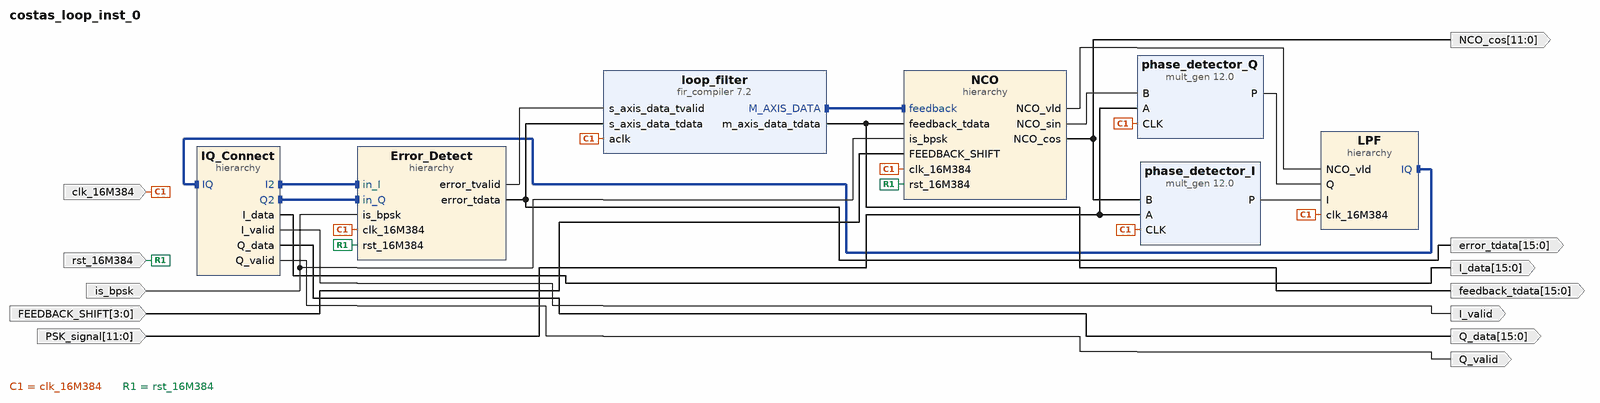
[diagram p0: block diagram of the top level]
# Vivado block design costas_loop_inst_0, xc7z020clg484-1, Vivado 2022.2
create_bd_design costas_loop_inst_0

create_bd_port -dir I -type clk clk_16M384
create_bd_port -dir I -from 11 -to 0 -type data PSK_signal
create_bd_port -dir I is_bpsk
create_bd_port -dir I -type rst rst_16M384
create_bd_port -dir O -from 11 -to 0 NCO_cos
create_bd_port -dir I -from 3 -to 0 -type data FEEDBACK_SHIFT
create_bd_port -dir O -from 15 -to 0 I_data
create_bd_port -dir O I_valid
create_bd_port -dir O -from 15 -to 0 Q_data
create_bd_port -dir O Q_valid
create_bd_port -dir O -from 15 -to 0 error_tdata
create_bd_port -dir O -from 15 -to 0 feedback_tdata

create_bd_cell -type ip -vlnv xilinx.com:ip:mult_gen:12.0 phase_detector_I
set_property -dict [list \
  CONFIG.Multiplier_Construction Use_Mults \
  CONFIG.OutputWidthHigh 23 \
  CONFIG.OutputWidthLow 8 \
  CONFIG.PipeStages 3 \
  CONFIG.PortAType Signed \
  CONFIG.PortAWidth 12 \
  CONFIG.PortBType Signed \
  CONFIG.PortBWidth 12 \
  CONFIG.Use_Custom_Output_Width true \
] [get_bd_cells phase_detector_I]
create_bd_cell -type ip -vlnv xilinx.com:ip:mult_gen:12.0 phase_detector_Q
set_property -dict [list \
  CONFIG.Multiplier_Construction Use_Mults \
  CONFIG.OutputWidthHigh 23 \
  CONFIG.OutputWidthLow 8 \
  CONFIG.PipeStages 3 \
  CONFIG.PortAType Signed \
  CONFIG.PortAWidth 12 \
  CONFIG.PortBType Signed \
  CONFIG.PortBWidth 12 \
  CONFIG.Use_Custom_Output_Width true \
] [get_bd_cells phase_detector_Q]
create_bd_cell -type ip -vlnv xilinx.com:ip:fir_compiler:7.2 loop_filter
set_property -dict [list \
  CONFIG.Clock_Frequency 16.384 \
  CONFIG.CoefficientSource COE_File \
  CONFIG.Coefficient_File ../../../../../../../../matlab/costas_loop_LPF.coe \
  CONFIG.Coefficient_Fractional_Bits 0 \
  CONFIG.Coefficient_Sets 1 \
  CONFIG.Coefficient_Sign Signed \
  CONFIG.Coefficient_Structure Inferred \
  CONFIG.Coefficient_Width 16 \
  CONFIG.ColumnConfig 14 \
  CONFIG.DATA_Has_TLAST Not_Required \
  CONFIG.Data_Width 16 \
  CONFIG.Filter_Architecture Systolic_Multiply_Accumulate \
  CONFIG.M_DATA_Has_TUSER Not_Required \
  CONFIG.Number_Channels 1 \
  CONFIG.Number_Paths 1 \
  CONFIG.Output_Rounding_Mode Truncate_LSBs \
  CONFIG.Output_Width 16 \
  CONFIG.Quantization Integer_Coefficients \
  CONFIG.RateSpecification Frequency_Specification \
  CONFIG.S_DATA_Has_TUSER Not_Required \
  CONFIG.SamplePeriod 1 \
  CONFIG.Sample_Frequency 16.384 \
  CONFIG.Select_Pattern All \
] [get_bd_cells loop_filter]
create_bd_cell -type hier Error_Detect
create_bd_cell -type hier IQ_Connect
create_bd_cell -type hier LPF
create_bd_cell -type hier NCO

# ---- hierarchy /Error_Detect ----
current_bd_instance /Error_Detect
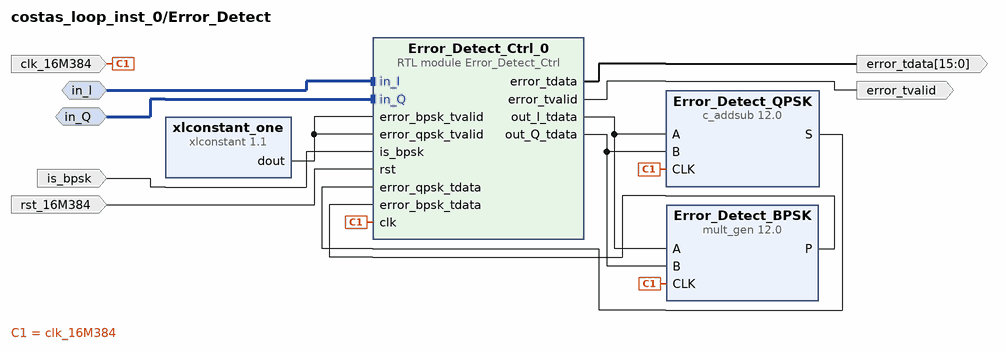
[diagram p1: block diagram inside /Error_Detect]
create_bd_intf_pin -mode Slave -vlnv xilinx.com:interface:axis_rtl:1.0 in_I
create_bd_intf_pin -mode Slave -vlnv xilinx.com:interface:axis_rtl:1.0 in_Q
create_bd_pin -dir I -type clk clk_16M384
create_bd_pin -dir I -type rst rst_16M384
create_bd_pin -dir I is_bpsk
create_bd_pin -dir O -from 15 -to 0 error_tdata
create_bd_pin -dir O error_tvalid

create_bd_cell -type ip -vlnv xilinx.com:ip:mult_gen:12.0 Error_Detect_BPSK
set_property -dict [list \
  CONFIG.Multiplier_Construction Use_Mults \
  CONFIG.OutputWidthHigh 31 \
  CONFIG.OutputWidthLow 16 \
  CONFIG.PipeStages 2 \
  CONFIG.PortAType Signed \
  CONFIG.PortAWidth 16 \
  CONFIG.PortBType Signed \
  CONFIG.PortBWidth 16 \
  CONFIG.Use_Custom_Output_Width true \
] [get_bd_cells Error_Detect_BPSK]
create_bd_cell -type ip -vlnv xilinx.com:ip:c_addsub:12.0 Error_Detect_QPSK
set_property -dict [list \
  CONFIG.A_Type Signed \
  CONFIG.A_Width 16 \
  CONFIG.Add_Mode Subtract \
  CONFIG.B_Type Signed \
  CONFIG.B_Value 0000000000000000 \
  CONFIG.B_Width 16 \
  CONFIG.CE false \
  CONFIG.Implementation DSP48 \
  CONFIG.Latency 2 \
  CONFIG.Out_Width 16 \
] [get_bd_cells Error_Detect_QPSK]
create_bd_cell -type ip -vlnv xilinx.com:ip:xlconstant:1.1 xlconstant_one
create_bd_cell -type module -reference Error_Detect_Ctrl Error_Detect_Ctrl_0

# ---- hierarchy /IQ_Connect ----
current_bd_instance /IQ_Connect
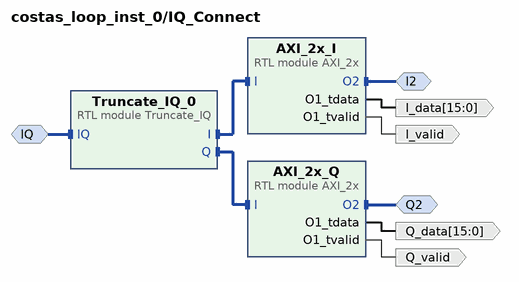
[diagram p2: block diagram inside /IQ_Connect]
create_bd_intf_pin -mode Master -vlnv xilinx.com:interface:axis_rtl:1.0 I2
create_bd_intf_pin -mode Master -vlnv xilinx.com:interface:axis_rtl:1.0 Q2
create_bd_intf_pin -mode Slave -vlnv xilinx.com:interface:axis_rtl:1.0 IQ
create_bd_pin -dir O -from 15 -to 0 I_data
create_bd_pin -dir O I_valid
create_bd_pin -dir O -from 15 -to 0 Q_data
create_bd_pin -dir O Q_valid

create_bd_cell -type module -reference AXI_2x AXI_2x_I
create_bd_cell -type module -reference AXI_2x AXI_2x_Q
create_bd_cell -type module -reference Truncate_IQ Truncate_IQ_0
set_property -dict {CONFIG.I_WIDTH 80 CONFIG.MSB_TRUNCATE_BITS 6} [get_bd_cells Truncate_IQ_0]

# ---- hierarchy /LPF ----
current_bd_instance /LPF
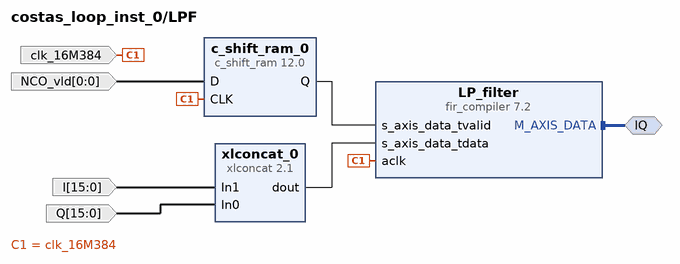
[diagram p3: block diagram inside /LPF]
create_bd_intf_pin -mode Master -vlnv xilinx.com:interface:axis_rtl:1.0 IQ
create_bd_pin -dir I -from 15 -to 0 I
create_bd_pin -dir I -from 15 -to 0 Q
create_bd_pin -dir I -type clk clk_16M384
create_bd_pin -dir I -from 0 -to 0 -type data NCO_vld

create_bd_cell -type ip -vlnv xilinx.com:ip:xlconcat:2.1 xlconcat_0
set_property -dict {CONFIG.IN0_WIDTH 16 CONFIG.IN1_WIDTH 16} [get_bd_cells xlconcat_0]
create_bd_cell -type ip -vlnv xilinx.com:ip:fir_compiler:7.2 LP_filter
set_property -dict [list \
  CONFIG.Clock_Frequency 16.384 \
  CONFIG.CoefficientSource COE_File \
  CONFIG.CoefficientVector 6,0,-4,-3,5,6,-6,-13,7,44,64,44,7,-13,-6,6,5,-3,-4,0,6 \
  CONFIG.Coefficient_File ../../../../../../../../matlab/costas_loop_LPF.coe \
  CONFIG.Coefficient_Fractional_Bits 0 \
  CONFIG.Coefficient_Sets 1 \
  CONFIG.Coefficient_Sign Signed \
  CONFIG.Coefficient_Structure Inferred \
  CONFIG.Coefficient_Width 16 \
  CONFIG.ColumnConfig 14 \
  CONFIG.DATA_Has_TLAST Not_Required \
  CONFIG.Data_Fractional_Bits 0 \
  CONFIG.Data_Width 16 \
  CONFIG.Filter_Architecture Systolic_Multiply_Accumulate \
  CONFIG.M_DATA_Has_TUSER Not_Required \
  CONFIG.Number_Channels 1 \
  CONFIG.Number_Paths 2 \
  CONFIG.Output_Rounding_Mode Full_Precision \
  CONFIG.Output_Width 34 \
  CONFIG.Quantization Integer_Coefficients \
  CONFIG.RateSpecification Frequency_Specification \
  CONFIG.S_DATA_Has_TUSER Not_Required \
  CONFIG.SamplePeriod 1 \
  CONFIG.Sample_Frequency 16.384 \
  CONFIG.Select_Pattern All \
] [get_bd_cells LP_filter]
create_bd_cell -type ip -vlnv xilinx.com:ip:c_shift_ram:12.0 c_shift_ram_0
set_property -dict {CONFIG.Depth 64 CONFIG.Width 1} [get_bd_cells c_shift_ram_0]

# ---- hierarchy /NCO ----
current_bd_instance /NCO
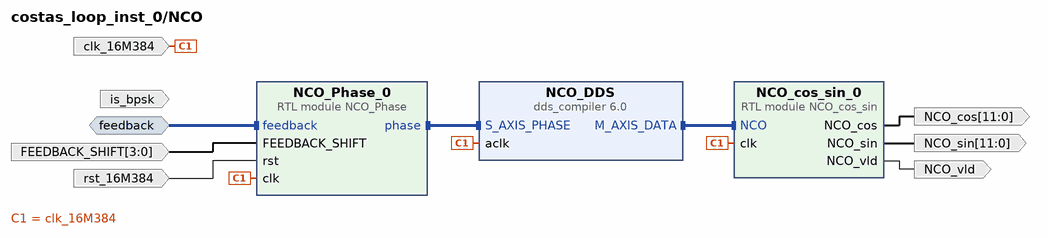
[diagram p4: block diagram inside /NCO]
create_bd_intf_pin -mode Slave -vlnv xilinx.com:interface:axis_rtl:1.0 feedback
create_bd_pin -dir O -from 11 -to 0 NCO_cos
create_bd_pin -dir O -from 11 -to 0 NCO_sin
create_bd_pin -dir I -type clk clk_16M384
create_bd_pin -dir I -type rst rst_16M384
create_bd_pin -dir I -from 3 -to 0 FEEDBACK_SHIFT
create_bd_pin -dir O NCO_vld
create_bd_pin -dir I is_bpsk

create_bd_cell -type ip -vlnv xilinx.com:ip:dds_compiler:6.0 NCO_DDS
set_property -dict [list \
  CONFIG.Amplitude_Mode Full_Range \
  CONFIG.DATA_Has_TLAST Not_Required \
  CONFIG.DDS_Clock_Rate 16.384 \
  CONFIG.DSP48_Use Maximal \
  CONFIG.Frequency_Resolution 0.4 \
  CONFIG.Has_Phase_Out false \
  CONFIG.Has_TREADY false \
  CONFIG.Latency 8 \
  CONFIG.M_DATA_Has_TUSER Not_Required \
  CONFIG.Noise_Shaping None \
  CONFIG.Optimization_Goal Auto \
  CONFIG.Output_Frequency1 0 \
  CONFIG.Output_Width 12 \
  CONFIG.PINC1 0 \
  CONFIG.Parameter_Entry Hardware_Parameters \
  CONFIG.PartsPresent Phase_Generator_and_SIN_COS_LUT \
  CONFIG.Phase_Increment Streaming \
  CONFIG.Phase_Width 16 \
  CONFIG.Phase_offset None \
  CONFIG.S_PHASE_Has_TUSER Not_Required \
  CONFIG.Spurious_Free_Dynamic_Range 45 \
] [get_bd_cells NCO_DDS]
create_bd_cell -type module -reference NCO_Phase NCO_Phase_0
create_bd_cell -type module -reference NCO_cos_sin NCO_cos_sin_0
set_property -dict {CONFIG.O_WIDTH 12} [get_bd_cells NCO_cos_sin_0]

# ---- connections ----

current_bd_instance /Error_Detect
connect_bd_intf_net -intf_net AXI_2x_I_O2 [get_bd_intf_pins in_I] [get_bd_intf_pins Error_Detect_Ctrl_0/in_I]
connect_bd_intf_net -intf_net AXI_2x_Q_O2 [get_bd_intf_pins in_Q] [get_bd_intf_pins Error_Detect_Ctrl_0/in_Q]
connect_bd_net [get_bd_pins Error_Detect_Ctrl_0/error_tdata] [get_bd_pins error_tdata]
connect_bd_net [get_bd_pins Error_Detect_Ctrl_0/error_tvalid] [get_bd_pins error_tvalid]
connect_bd_net [get_bd_pins Error_Detect_Ctrl_0/out_I_tdata] [get_bd_pins Error_Detect_BPSK/A] [get_bd_pins Error_Detect_QPSK/A]
connect_bd_net [get_bd_pins Error_Detect_Ctrl_0/out_Q_tdata] [get_bd_pins Error_Detect_BPSK/B] [get_bd_pins Error_Detect_QPSK/B]
connect_bd_net [get_bd_pins Error_Detect_QPSK/S] [get_bd_pins Error_Detect_Ctrl_0/error_qpsk_tdata]
connect_bd_net -net aclk_0_1 [get_bd_pins clk_16M384] \
  [get_bd_pins Error_Detect_QPSK/CLK] [get_bd_pins Error_Detect_BPSK/CLK] [get_bd_pins Error_Detect_Ctrl_0/clk]
connect_bd_net [get_bd_pins is_bpsk] [get_bd_pins Error_Detect_Ctrl_0/is_bpsk]
connect_bd_net -net mult_gen_0_P [get_bd_pins Error_Detect_BPSK/P] [get_bd_pins Error_Detect_Ctrl_0/error_bpsk_tdata]
connect_bd_net -net rst_16M386_1 [get_bd_pins rst_16M384] [get_bd_pins Error_Detect_Ctrl_0/rst]
connect_bd_net -net xlconstant_valid_one_dout [get_bd_pins xlconstant_one/dout] \
  [get_bd_pins Error_Detect_Ctrl_0/error_bpsk_tvalid] [get_bd_pins Error_Detect_Ctrl_0/error_qpsk_tvalid]

current_bd_instance /IQ_Connect
connect_bd_intf_net -intf_net AXI_2x_I1_O2 [get_bd_intf_pins Q2] [get_bd_intf_pins AXI_2x_Q/O2]
connect_bd_intf_net [get_bd_intf_pins I2] [get_bd_intf_pins AXI_2x_I/O2]
connect_bd_intf_net [get_bd_intf_pins Truncate_IQ_0/I] [get_bd_intf_pins AXI_2x_I/I]
connect_bd_intf_net [get_bd_intf_pins AXI_2x_Q/I] [get_bd_intf_pins Truncate_IQ_0/Q]
connect_bd_intf_net -intf_net fir_compiler_I_M_AXIS_DATA [get_bd_intf_pins IQ] [get_bd_intf_pins Truncate_IQ_0/IQ]
connect_bd_net [get_bd_pins AXI_2x_I/O1_tdata] [get_bd_pins I_data]
connect_bd_net [get_bd_pins AXI_2x_I/O1_tvalid] [get_bd_pins I_valid]
connect_bd_net [get_bd_pins AXI_2x_Q/O1_tdata] [get_bd_pins Q_data]
connect_bd_net [get_bd_pins AXI_2x_Q/O1_tvalid] [get_bd_pins Q_valid]

current_bd_instance /LPF
connect_bd_intf_net -intf_net fir_compiler_I_M_AXIS_DATA [get_bd_intf_pins IQ] [get_bd_intf_pins LP_filter/M_AXIS_DATA]
connect_bd_net -net D_1 [get_bd_pins NCO_vld] [get_bd_pins c_shift_ram_0/D]
connect_bd_net [get_bd_pins I] [get_bd_pins xlconcat_0/In1]
connect_bd_net [get_bd_pins Q] [get_bd_pins xlconcat_0/In0]
connect_bd_net -net aclk_0_1 [get_bd_pins clk_16M384] [get_bd_pins LP_filter/aclk] [get_bd_pins c_shift_ram_0/CLK]
connect_bd_net [get_bd_pins c_shift_ram_0/Q] [get_bd_pins LP_filter/s_axis_data_tvalid]
connect_bd_net [get_bd_pins xlconcat_0/dout] [get_bd_pins LP_filter/s_axis_data_tdata]

current_bd_instance /NCO
connect_bd_intf_net -intf_net NCO_M_AXIS_DATA [get_bd_intf_pins NCO_cos_sin_0/NCO] [get_bd_intf_pins NCO_DDS/M_AXIS_DATA]
connect_bd_intf_net [get_bd_intf_pins NCO_Phase_0/phase] [get_bd_intf_pins NCO_DDS/S_AXIS_PHASE]
connect_bd_intf_net [get_bd_intf_pins feedback] [get_bd_intf_pins NCO_Phase_0/feedback]
connect_bd_net [get_bd_pins FEEDBACK_SHIFT] [get_bd_pins NCO_Phase_0/FEEDBACK_SHIFT]
connect_bd_net [get_bd_pins NCO_cos_sin_0/NCO_cos] [get_bd_pins NCO_cos]
connect_bd_net [get_bd_pins NCO_cos_sin_0/NCO_sin] [get_bd_pins NCO_sin]
connect_bd_net [get_bd_pins NCO_cos_sin_0/NCO_vld] [get_bd_pins NCO_vld]
connect_bd_net -net aclk_0_1 [get_bd_pins clk_16M384] [get_bd_pins NCO_DDS/aclk] [get_bd_pins NCO_Phase_0/clk] [get_bd_pins NCO_cos_sin_0/clk]
# net is_bpsk_1 has one end: is_bpsk
connect_bd_net -net rst_16M384_1 [get_bd_pins rst_16M384] [get_bd_pins NCO_Phase_0/rst]

current_bd_instance /
connect_bd_intf_net -intf_net AXI_2x_I_O2 [get_bd_intf_pins IQ_Connect/I2] [get_bd_intf_pins Error_Detect/in_I]
connect_bd_intf_net -intf_net AXI_2x_Q_O2 [get_bd_intf_pins IQ_Connect/Q2] [get_bd_intf_pins Error_Detect/in_Q]
connect_bd_intf_net -intf_net fir_compiler_I_M_AXIS_DATA [get_bd_intf_pins LPF/IQ] [get_bd_intf_pins IQ_Connect/IQ]
connect_bd_intf_net [get_bd_intf_pins loop_filter/M_AXIS_DATA] [get_bd_intf_pins NCO/feedback]
connect_bd_net [get_bd_pins Error_Detect/error_tdata] [get_bd_pins loop_filter/s_axis_data_tdata] [get_bd_ports error_tdata]
connect_bd_net [get_bd_pins Error_Detect/error_tvalid] [get_bd_pins loop_filter/s_axis_data_tvalid]
connect_bd_net [get_bd_ports FEEDBACK_SHIFT] [get_bd_pins NCO/FEEDBACK_SHIFT]
connect_bd_net -net IQ_Connect_I1_tdata [get_bd_pins IQ_Connect/I_data] [get_bd_ports I_data]
connect_bd_net -net IQ_Connect_I1_tvalid [get_bd_pins IQ_Connect/I_valid] [get_bd_ports I_valid]
connect_bd_net -net IQ_Connect_Q1_tdata [get_bd_pins IQ_Connect/Q_data] [get_bd_ports Q_data]
connect_bd_net -net IQ_Connect_Q1_tvalid [get_bd_pins IQ_Connect/Q_valid] [get_bd_ports Q_valid]
connect_bd_net [get_bd_pins NCO/NCO_sin] [get_bd_pins phase_detector_Q/B]
connect_bd_net [get_bd_pins NCO/NCO_vld] [get_bd_pins LPF/NCO_vld]
connect_bd_net -net NCO_cos_sin_0_NCO_cos [get_bd_pins NCO/NCO_cos] [get_bd_ports NCO_cos] [get_bd_pins phase_detector_I/B]
connect_bd_net [get_bd_ports PSK_signal] [get_bd_pins phase_detector_I/A] [get_bd_pins phase_detector_Q/A]
connect_bd_net -net aclk_0_1 [get_bd_ports clk_16M384] \
  [get_bd_pins phase_detector_I/CLK] [get_bd_pins phase_detector_Q/CLK] [get_bd_pins loop_filter/aclk] \
  [get_bd_pins Error_Detect/clk_16M384] [get_bd_pins LPF/clk_16M384] [get_bd_pins NCO/clk_16M384]
connect_bd_net [get_bd_ports is_bpsk] [get_bd_pins Error_Detect/is_bpsk] [get_bd_pins NCO/is_bpsk]
connect_bd_net [get_bd_pins loop_filter/m_axis_data_tdata] [get_bd_pins NCO/feedback_tdata] [get_bd_ports feedback_tdata]
connect_bd_net [get_bd_pins phase_detector_I/P] [get_bd_pins LPF/I]
connect_bd_net [get_bd_pins phase_detector_Q/P] [get_bd_pins LPF/Q]
connect_bd_net -net rst_16M386_1 [get_bd_ports rst_16M384] [get_bd_pins Error_Detect/rst_16M384] [get_bd_pins NCO/rst_16M384]

validate_bd_design
save_bd_design
